# Altium project InterfaceBoard.PrjPcb
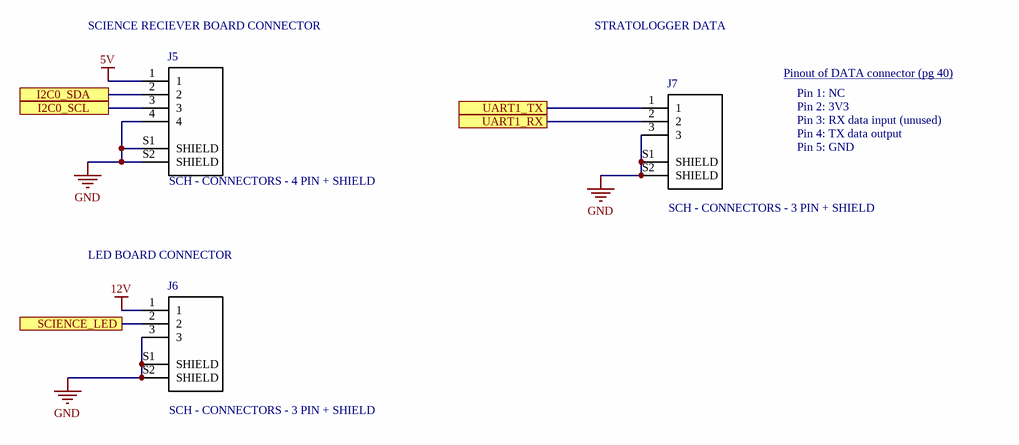
[diagram p0: Board_Conns.SchDoc]
6 sheets, 53 parts. Net scope: flat (ports and power ports of the same name join across sheets).
Board file: InterfaceBoard.PcbDoc
Sheets:
  Board_Conns.SchDoc
  Buzzer_and_Solenoid.SchDoc
  Deploy_Switches.SchDoc
  EMatches.SchDoc
  MEZZANINE.SchDoc
  Table_of_Contents.SchDoc

## Sheet Board_Conns.SchDoc: SPEX - INTERFACE - CONNS
size A4; Author: Derek Belsky; Revision: 0; SheetNumber: 6; SheetTotal: 6

### Parts
J5  SCH - CONNECTORS - 4 PIN + SHIELD  [PCB - CONNECTOR - MOLEX - PICO-LOCK 5037630491]
J6  SCH - CONNECTORS - 3 PIN + SHIELD  [PCB - CONNECTOR - MOLEX - PICO-LOCK 5037630391]
J7  SCH - CONNECTORS - 3 PIN + SHIELD  [PCB - CONNECTOR - MOLEX - PICO-LOCK 5037630391]

### Ports
I2C0_SCL, I2C0_SDA, SCIENCE_LED, UART1_RX, UART1_TX

### Nets
5V: J5.1
12V: J6.1
GND: J5.4 J5.S1(SHIELD) J5.S2(SHIELD) J6.3 J6.S1(SHIELD) J6.S2(SHIELD) J7.3 J7.S1(SHIELD) J7.S2(SHIELD)
I2C0_SCL: J5.3 ; port I2C0_SCL
I2C0_SDA: J5.2 ; port I2C0_SDA
SCIENCE_LED: J6.2 ; port SCIENCE_LED
UART1_S2T: J7.2 ; port UART1_RX
UART1_T2S: J7.1 ; port UART1_TX

### Notes on the sheet
- (near J5) SCIENCE RECIEVER BOARD CONNECTOR
- STRATOLOGGER DATA
- Pinout of DATA connector (pg 40) <http://www.perfectflite.com/Downloads/StratoLoggerCF%20manual.pdf>
- Pin 1: NC
- Pin 2: 3V3
- Pin 3: RX data input (unused)
- Pin 4: TX data output
- Pin 5: GND
- (near J6) LED BOARD CONNECTOR
- Title
- Size:
- Date:
- A4
- Author
- Time:
- Sheet
- Revision:
- of
- RIT Space Exploration Team
- Rochester Institute of Technology
- 1 Lomb Memorial Drive
- Rochester, NY 14623
- https://spex.rit.edu
- File:

### Library data of the parts
J5 = SCH - CONNECTORS - 4 PIN + SHIELD: Connector Header Surface Mount, Right Angle 4 position 0.039 _1.00mm_; MF: Molex; MP: 5037630491; SnapEDA_Link: https://www.snapeda.com/parts/5037630491/Molex/view-part/3215405/?ref=snap; Package: None; Price: None; Availability: Unavailable; Value: *
J6 J7 = SCH - CONNECTORS - 3 PIN + SHIELD: Connector Header Surface Mount, Right Angle 4 position 0.039 _1.00mm_; MF: Molex; MP: 5037630491; SnapEDA_Link: https://www.snapeda.com/parts/5037630491/Molex/view-part/3215405/?ref=snap; Package: None; Price: None; Availability: Unavailable; Value: *

## Sheet Buzzer_and_Solenoid.SchDoc: SPEX - INTERFACE - BUZZER
size A4; Author: Derek Belsky; Revision: 0; SheetNumber: 5; SheetTotal: 6
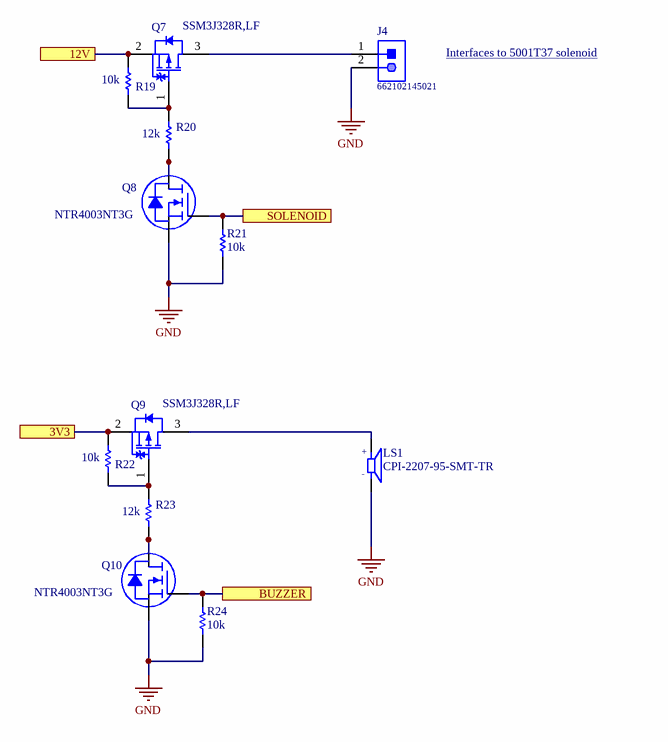
[diagram p1: Buzzer_and_Solenoid.SchDoc]

### Parts
J4  662102145021  [662102145021]
LS1  CPI-2207-95-SMT-TR  [XDCR_CPI-2207-95-SMT-TR]
Q7  SSM3J328R,LF  [TOSH-SOT-23F_V]
Q8  NTR4003NT3G  [ON SEMI SOT-23-3]
Q9  SSM3J328R,LF  [TOSH-SOT-23F_V]
Q10  NTR4003NT3G  [ON SEMI SOT-23-3]
R19  value 10k  [RESC1609X50X30NL8T20]  (hidden comment: CRCW060310K0FKEA)
R20  value 12k  [RESC1609X50X30LL10T20]  (hidden comment: CRCW060312K0FKEA)
R21  value 10k  [RESC1609X50X30NL8T20]  (hidden comment: CRCW060310K0FKEA)
R22  value 10k  [RESC1609X50X30NL8T20]  (hidden comment: CRCW060310K0FKEA)
R23  value 12k  [RESC1609X50X30LL10T20]  (hidden comment: CRCW060312K0FKEA)
R24  value 10k  [RESC1609X50X30NL8T20]  (hidden comment: CRCW060310K0FKEA)

### Ports
3V3, 12V, BUZZER, SOLENOID

### Nets
GND: J4.2 LS1.N Q8.2(S) Q10.2(S) R21.2 R24.2
BUZZER: Q10.1(G) R24.1 ; port BUZZER
SOLENOID: Q8.1(G) R21.1 ; port SOLENOID
NetJ4_1: J4.1 Q7.3(D)
NetLS1_P: LS1.P Q9.3(D)
NetQ7_1: Q7.1(G) R19.1 R20.2
NetQ7_2: Q7.2(S) R19.2 ; port 12V
NetQ8_3: Q8.3(D) R20.1
NetQ9_1: Q9.1(G) R22.1 R23.2
NetQ9_2: Q9.2(S) R22.2 ; port 3V3
NetQ10_3: Q10.3(D) R23.1

### Notes on the sheet
- Interfaces to 5001T37 solenoid <https://www.mcmaster.com/5001t37>
- Title
- Size:
- Date:
- A4
- Author:
- Time:
- Sheet
- Revision:
- of
- RIT Space Exploration Team
- Rochester Institute of Technology
- 1 Lomb Memorial Drive
- Rochester, NY 14623
- https://spex.rit.edu
- File:
- (in symbol CPI-2207-95-SMT-TR) +; -

### Library data of the parts
J4 = CMP-1502-00482-1: SMT Male Header WR-MPC3, with SMT Solder Tabs, Right Angled, Single Row, pitch 3 mm, 2 pins; Manufacturer: Wurth Elektronik; Contact Resistance: 10mOhm; Working Voltage: 250VAC; Pitch: 3mm; Pin Number: 2; Mounting Technology: SMT; Orientation: RightAngled; Part Number: 662102145021; Datasheet URL: https://katalog.we-online.de/em/datasheet/6621xx145021.pdf; Manufacturer URL: http://www.we-online.de; Packaging: TapeandReel; Publisher: WurthElektronik; Gender: Male; Operating Temperature: -40to105degC; Package Reference: 662102145021
LS1 = CPI-2207-95-SMT-TR: 22.1 mm, 12 Vdc, 95 dB, Surface Mount, Driving Circuit, Piezo Audio Indicator Buzzer; MF: CUI Devices; CUI_purchase_URL: https://www.cuidevices.com/product/audio/buzzers/audio-indicators/cpi-2207-95-smt-tr?utm_source=snapeda.com&utm_medium=referral&utm_campaign=snapedaBOM; Digi-Key_Purchase_URL: https://www.digikey.com/product-detail/en/cui-devices/CPI-2207-95-SMT-TR/2223-CPI-2207-95-SMT-CT-ND/11591340?utm_source=snapeda&utm_medium=aggregator&utm_campaign=symbol; Digi-Key_Part_Number: 2223-CPI-2207-95-SMT-CT-ND; Package: CUI Devices; Value: *; SnapEDA_Link: https://www.snapeda.com/parts/CPI-2207-95-SMT-TR/CUI%20Devices/view-part/4502466/?ref=snap; MP: CPI-2207-95-SMT-TR
Q7 Q9 = CMP-2100-03686-1: TOSHIBA Field-Effect Transistor Silicon P-Channel MOS Type (U-MOS VI), 20 V, -55 to 125 degC, 3-Pin SOTFL, RoHS, Tape and Reel; Gate to Source Voltage (Vgs): 8V; Drain to Source Breakdown Voltage: -20V; Turn-Off Delay Time: 107ns; Continuous Drain Current (ID): 6A; Rds On Max: 29.8mOhm; Number of Elements: 1; Turn-On Delay Time: 32ns; Drain to Source Resistance: 47.4mOhm; Drain to Source Voltage (Vdss): 20V; Power Dissipation: 2W; Element Configuration: Single; Max Power Dissipation: 1W; Input Capacitance: 840pF; Manufacturer URL: http://www.toshiba.com/; Number of Pins: 3; Number of Channels: 1; Max Operating Temperature: 150degC; Min Operating Temperature: -55degC; Manufacturer: Toshiba; Mount: SurfaceMount; Package Description: 3-Pin Small Outline Transistor, Flat Lead, Body 2.9 x 1.8 mm, Pitch 0.95 mm; Radiation Hardening: No; Package Quantity: 3000; Package Reference: SOT-23F; RoHSCompliant: true; Package URL: https://toshiba.semicon-storage.com/ap-en/design-support/package/detail.SOT-23F.html; Packaging: TapeandReel; Datasheet Version: 41699.0; Case/Package: SOT-23-3; Datasheet URL: https://toshiba.semicon-storage.com/info/docget.jsp?did=2429&prodName=SSM3J328R
Q8 Q10 = NTR4003NT3G: MOSFET N-CH 30V 500MA SOT-23; Manufacturer: ON Semiconductor; Current - Continuous Drain (Id) @ 25°C: 500mA (Ta); Drive Voltage (Max Rds On,  Min Rds On): 2.5V, 4V; FET Type: N-Channel; Gate Charge (Qg) (Max) @ Vgs: 1.15nC @ 5V; Input Capacitance (Ciss) (Max) @ Vds: 21pF @ 5V; Power Dissipation (Max): 690mW (Ta); Rds On (Max) @ Id, Vgs: 1.5Ohm @ 10mA, 4V; Vgs (Max): ±20V; Vgs(th) (Max) @ Id: 1.4V @ 250µA; Part Number: NTR4003NT3G; ComponentLink1Description: Datasheet; ComponentLink1URL: http://www.onsemi.com/pub/Collateral/NTR4003N-D.PDF; ComponentLink2Description: DigiKey Link; ComponentLink2URL: http://digikey.com/product-detail/en/on-semiconductor/NTR4003NT3G/NTR4003NT3GOSCT-ND/1967271; Device Package: TO-236-3, SC-59, SOT-23-3; Drain to Source Voltage (Vdss): 30V; LastUpdated: 1/21/2020 4:01:12 AM; Lifecycle Status: Active; Minimum Order: 1; Mounting Type: Surface Mount; Operating Temperature: -55°C ~ 150°C (TJ); Package / Case: TO-236-3, SC-59, SOT-23-3; Packaging: TapeAndReel; Part Status: Active; Price: 0.04; Series: -; Supplier 1: DigiKey; Supplier Part Number 1: NTR4003NT3GOSCT-ND; Supplier Device Package: SOT-23-3 (TO-236); Technology: MOSFET (Metal Oxide)
R19 R21 R22 R24 = CMP-1666-00005-4: Chip Resistor, 10 KOhm, +/- 1%, 100 mW, -55 to 155 degC, 0603 (1608 Metric), RoHS, Tape and Reel; Manufacturer: Vishay Semiconductor; Voltage Rating: 75 V; Max Operating Temperature: 155 degC; PackageDescription: 2-Pin Surface Mount Device, Body 1.575 x 0.85 mm; ComponentLink1Description: Manufacturer URL; RoHSCompliant: true; PackageReference: 0603; REACH SVHC: Unknown; Length: 1.55 mm; DatasheetVersion: 06/2012; Packaging: Tape and Reel; Min Operating Temperature: -55 degC; Mounting Technology: Surface Mount; ComponentLink2URL: https://datasheet.ciiva.com/11809/0900766b80d98afc-11809037.pdf; Height: 0.45 mm; ComponentLink2Description: Datasheet; Package Quantity: 5000; ComponentLink1URL: http://www.vishay.com/
R20 R23 = CMP-2000-03877-1: Manufacturer: Vishay Dale; Part Number: CRCW060312K0FKEA

## Sheet Deploy_Switches.SchDoc: SPEX - INTERFACE - SWITCHES
size A4; Author: Derek Belsky; Revision: 0; SheetNumber: 4; SheetTotal: 6
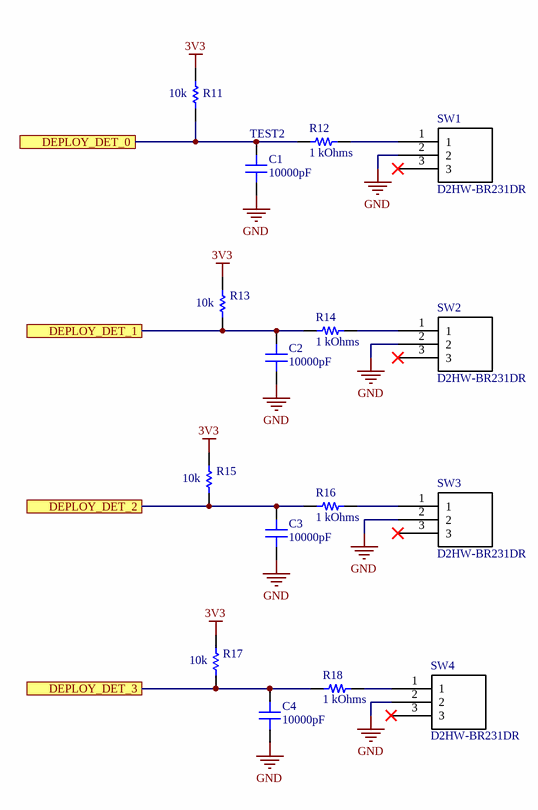
[diagram p2: Deploy_Switches.SchDoc]

### Parts
C1  10000pF  [CAP 0603_1608]
C2  10000pF  [CAP 0603_1608]
C3  10000pF  [CAP 0603_1608]
C4  10000pF  [CAP 0603_1608]
R11  value 10k  [RES 0603_1608]  (hidden comment: 1 kOhms)
R12  1 kOhms  [RES 0603_1608]
R13  value 10k  [RESC1609X50X30NL8T20]  (hidden comment: CRCW060310K0FKEA)
R14  1 kOhms  [RES 0603_1608]
R15  value 10k  [RES 0603_1608]  (hidden comment: 1 kOhms)
R16  value 1 kOhms  [RESC1609X50X30NL8T20]  (hidden comment: CRCW060310K0FKEA)
R17  value 10k  [RES 0603_1608]  (hidden comment: 1 kOhms)
R18  value 1 kOhms  [RESC1609X50X30NL8T20]  (hidden comment: CRCW060310K0FKEA)
SW1  D2HW-BR231DR
SW2  D2HW-BR231DR
SW3  D2HW-BR231DR
SW4  D2HW-BR231DR

### Ports
DEPLOY_DET_0, DEPLOY_DET_1, DEPLOY_DET_2, DEPLOY_DET_3

### Nets
3V3: R11.2 R13.2 R15.2 R17.2
GND: C1.1 C2.1 C3.1 C4.1 SW1.2 SW2.2 SW3.2 SW4.2
DEPLOY_DET_0: C1.2 R11.2 R12.1 ; port DEPLOY_DET_0
DEPLOY_DET_1: C2.2 R13.1 R14.1 ; port DEPLOY_DET_1
DEPLOY_DET_2: C3.2 R15.2 R16.1 ; port DEPLOY_DET_2
DEPLOY_DET_3: C4.2 R17.2 R18.1 ; port DEPLOY_DET_3
NetR12_2: R12.2 SW1.1
NetR14_2: R14.2 SW2.1
NetR16_2: R16.2 SW3.1
NetR18_2: R18.2 SW4.1

Not connected (* = marked no-connect by the designer): SW1 3*; SW2 3*; SW3 3*; SW4 3*

### Notes on the sheet
- (near C1) TEST2
- Title
- Size:
- Date:
- A4
- Author:
- Time:
- Sheet
- Revision:
- of
- RIT Space Exploration Team
- Rochester Institute of Technology
- 1 Lomb Memorial Drive
- Rochester, NY 14623
- https://spex.rit.edu
- File:

### Library data of the parts
C1-C4 = C0603S103K4RACTU: CAP CER 10000PF 16V X7R 0603; Manufacturer: KEMET; Tolerance: ±10%; Part Number: C0603S103K4RACTU; Value: 10000pF; Applications: Boardflex Sensitive; Capacitance: 10000pF; ComponentLink1Description: Datasheet; ComponentLink1URL: https://api.kemet.com/component-edge/download/datasheet/C0603S103K4RACTU.pdf; ComponentLink2Description: DigiKey Link; ComponentLink2URL: http://digikey.com/product-detail/en/kemet/C0603S103K4RACTU/399-9135-1-ND/3522653; Device Package: 0603 (1608 Metric); Features: Floating Electrode; LastUpdated: 1/21/2020 12:02:08 AM; Lifecycle Status: Active; Minimum Order: 1; Mounting Type: Surface Mount, MLCC; Operating Temperature: -55°C ~ 125°C; Package / Case: 0603 (1608 Metric); Packaging: TapeAndReel; PartId: 3312; Part Status: Active; Price: 0.07; Series: SMD Comm X7R FE; Size / Dimension: 0.063" L x 0.031" W (1.60mm x 0.80mm); Supplier 1: DigiKey; Supplier Part Number 1: 399-9135-1-ND; Temperature Coefficient: X7R; Thickness (Max): 0.034" (0.87mm); Voltage - Rated: 16V
R11 R13 R15 R17 = CMP-1666-00005-4: as R19 on sheet Buzzer_and_Solenoid; Max Operating Temperature: 155 degC; PackageDescription: 2-Pin Surface Mount Device, Body 1.575 x 0.85 mm; ComponentLink1Description: Manufacturer URL; RoHSCompliant: true; PackageReference: 0603; REACH SVHC: Unknown; Length: 1.55 mm; DatasheetVersion: 06/2012; Packaging: Tape and Reel; Min Operating Temperature: -55 degC; Mounting Technology: Surface Mount; ComponentLink2URL: https://datasheet.ciiva.com/11809/0900766b80d98afc-11809037.pdf; Height: 0.45 mm; ComponentLink2Description: Datasheet; Package Quantity: 5000; ComponentLink1URL: http://www.vishay.com/
R12 R14 R16 R18 = CPF0603B1K0E: RES SMD 1K OHM 0.1% 1/16W 0603; Manufacturer: TE Connectivity Passive Product; Power (Watts): 0.063W, 1/16W; Temperature Coefficient: ±25ppm/°C; Part Number: CPF0603B1K0E; ComponentLink1Description: Datasheet; ComponentLink1URL: https://www.te.com/commerce/DocumentDelivery/DDEController?Action=srchrtrv&DocNm=1773200&DocType=DS&DocLang=English; ComponentLink2Description: DigiKey Link; ComponentLink2URL: http://digikey.com/product-detail/en/te-connectivity-passive-product/CPF0603B1K0E/A119887CT-ND/4966485; Composition: Thin Film; Device Package: 0603 (1608 Metric); Height - Seated (Max): 0.022" (0.55mm); LastUpdated: 1/21/2020 12:24:55 AM; Lifecycle Status: Active; Minimum Order: 1; Number of Terminations: 2; Operating Temperature: -55°C ~ 155°C; Package / Case: 0603 (1608 Metric); Packaging: TapeAndReel; PartId: 4877; Part Status: Active; Price: 0.09; Resistance: 1 kOhms; Series: CPF, Neohm; Size / Dimension: 0.061" L x 0.031" W (1.55mm x 0.80mm); Supplier 1: DigiKey; Supplier Part Number 1: A119887CT-ND; Supplier Device Package: 0603; Tolerance: ±0.1%
  R12 R14: Value: 1 kOhms

## Sheet EMatches.SchDoc: SPEX - INTERFACE - EMATCHES
size A4; Author: Derek Belsky; Revision: 0; SheetNumber: 3; SheetTotal: 6
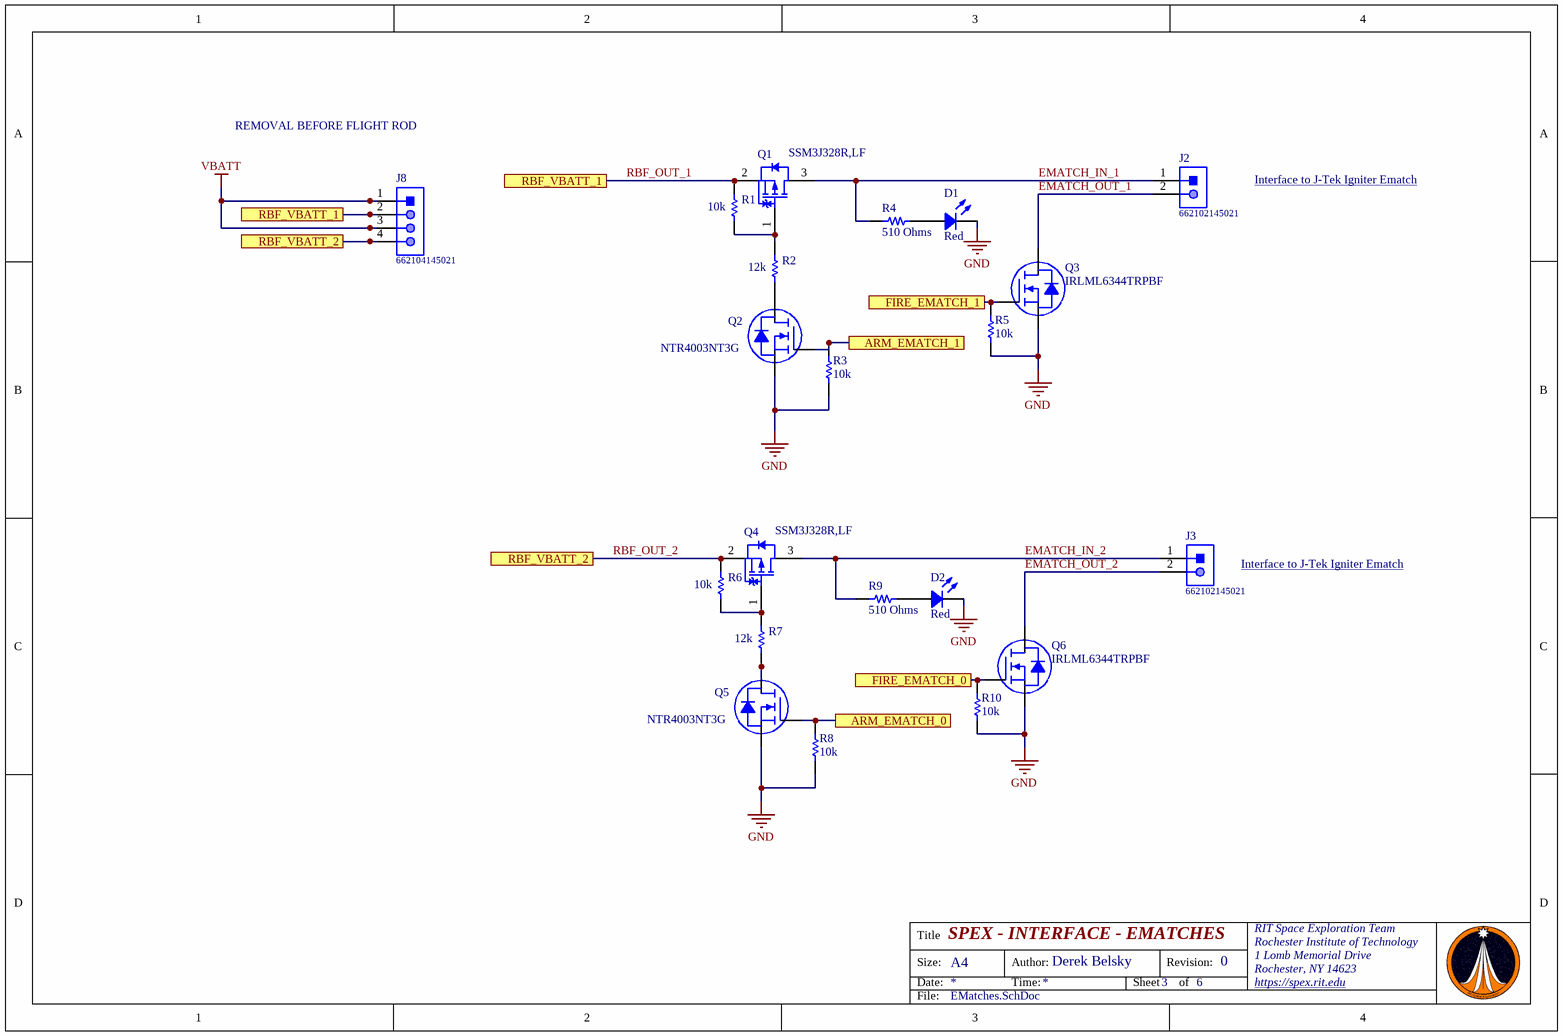
[diagram p3: EMatches.SchDoc]

### Parts
D1  Red  [LED 1206_3216 RED]
D2  Red  [LED 1206_3216 RED]
J2  662102145021  [662102145021]
J3  662102145021  [662102145021]
J8  662104145021  [662104145021]
Q1  SSM3J328R,LF  [TOSH-SOT-23F_V]
Q2  NTR4003NT3G  [ON SEMI SOT-23-3]
Q3  IRLML6344TRPBF  [INFINEON SOT-23-3]
Q4  SSM3J328R,LF  [TOSH-SOT-23F_V]
Q5  NTR4003NT3G  [ON SEMI SOT-23-3]
Q6  IRLML6344TRPBF  [INFINEON SOT-23-3]
R1  value 10k  [RESC1609X50X30NL8T20]  (hidden comment: CRCW060310K0FKEA)
R2  value 12k  [RESC1609X50X30LL10T20]  (hidden comment: CRCW060312K0FKEA)
R3  value 10k  [RESC1609X50X30NL8T20]  (hidden comment: CRCW060310K0FKEA)
R4  510 Ohms  [RES 0603_1608]
R5  value 10k  [RESC1609X50X30NL8T20]  (hidden comment: CRCW060310K0FKEA)
R6  value 10k  [RESC1609X50X30NL8T20]  (hidden comment: CRCW060310K0FKEA)
R7  value 12k  [RESC1609X50X30LL10T20]  (hidden comment: CRCW060312K0FKEA)
R8  value 10k  [RESC1609X50X30NL8T20]  (hidden comment: CRCW060310K0FKEA)
R9  510 Ohms  [RES 0603_1608]
R10  value 10k  [RESC1609X50X30NL8T20]  (hidden comment: CRCW060310K0FKEA)

### Ports
ARM_EMATCH_0, ARM_EMATCH_1, FIRE_EMATCH_0, FIRE_EMATCH_1, RBF_VBATT_1, RBF_VBATT_2

### Nets
GND: D1.2 D2.2 Q2.2(S) Q3.2(S) Q5.2(S) Q6.2(S) R3.2 R5.2 R8.2 R10.2
VBATT: J8.1 J8.3
ARM_EMATCH_0: Q5.1(G) R8.1 ; port ARM_EMATCH_0
ARM_EMATCH_1: Q2.1(G) R3.1 ; port ARM_EMATCH_1
EMATCH_IN_1: J2.1 Q1.3(D) R4.1
EMATCH_IN_2: J3.1 Q4.3(D) R9.1
EMATCH_OUT_1: J2.2 Q3.3(D)
EMATCH_OUT_2: J3.2 Q6.3(D)
FIRE_EMATCH_0: Q6.1(G) R10.1 ; port FIRE_EMATCH_0
FIRE_EMATCH_1: Q3.1(G) R5.1 ; port FIRE_EMATCH_1
RBF_OUT_1: J8.2 Q1.2(S) R1.2 ; port RBF_VBATT_1
RBF_OUT_2: J8.4 Q4.2(S) R6.2 ; port RBF_VBATT_2
NetD1_1: D1.1 R4.2
NetD2_1: D2.1 R9.2
NetQ1_1: Q1.1(G) R1.1 R2.2
NetQ2_3: Q2.3(D) R2.1
NetQ4_1: Q4.1(G) R6.1 R7.2
NetQ5_3: Q5.3(D) R7.1

### Notes on the sheet
- REMOVAL BEFORE FLIGHT ROD
- Interface to J-Tek Igniter Ematch <https://electricmatch.com/pyrotechnics/see/9/5/j-tek-igniter>
- Title
- Size:
- Date:
- A4
- Author:
- Time:
- Sheet
- Revision:
- of
- RIT Space Exploration Team
- Rochester Institute of Technology
- 1 Lomb Memorial Drive
- Rochester, NY 14623
- https://spex.rit.edu
- File:

### Library data of the parts
D1 D2 = HSMC-C350: LED RED CHIP SMD; Manufacturer: Broadcom Limited; Configuration: Standard; Current - Test: 20mA; Lens Color: 1.20mm; Lens Size: 1.10mm Dia; Lens Style: Round with Domed Top; Viewing Angle: 70°; Voltage - Forward (Vf) (Typ): 2V; Wavelength - Dominant: 630nm; Wavelength - Peak: 643nm; Part Number: HSMC-C350; Color: Red; ComponentLink1Description: Datasheet; ComponentLink1URL: https://docs.broadcom.com/docs/HSMC-C350-DS100; ComponentLink2Description: DigiKey Link; ComponentLink2URL: http://digikey.com/product-detail/en/broadcom-limited/HSMC-C350/516-4369-1-ND/10239796; Device Package: 1206 (3216 Metric); Height (Max): 1.20mm; LastUpdated: 1/21/2020 3:14:28 AM; Lifecycle Status: Active; Minimum Order: 1; Mounting Type: Surface Mount; Package / Case: 1206 (3216 Metric); Packaging: TapeAndReel; PartId: 195; Part Status: Active; Price: 0.21; Series: -; Size / Dimension: 3.20mm L x 1.60mm W; Supplier 1: DigiKey; Supplier Part Number 1: 516-4369-1-ND; Supplier Device Package: Chip LED; Value: Red
J2 J3 = CMP-1502-00482-1: as J4 on sheet Buzzer_and_Solenoid; Mounting Technology: SMT; Orientation: RightAngled; Part Number: 662102145021; Datasheet URL: https://katalog.we-online.de/em/datasheet/6621xx145021.pdf; Manufacturer URL: http://www.we-online.de; Packaging: TapeandReel; Publisher: WurthElektronik; Gender: Male; Operating Temperature: -40to105degC; Package Reference: 662102145021
J8 = CMP-1502-00484-1: SMT Male Header WR-MPC3, with SMT Solder Tabs, Right Angled, Single Row, pitch 3 mm, 4 pins; Manufacturer: Wurth Elektronik; Pitch: 3mm; Pin Number: 4; Working Voltage: 250VAC; Contact Resistance: 10mOhm; Part Number: 662104145021; Packaging: TapeandReel; Manufacturer URL: http://www.we-online.de; Orientation: RightAngled; Datasheet URL: https://katalog.we-online.de/em/datasheet/6621xx145021.pdf; Operating Temperature: -40to105degC; Publisher: WurthElektronik; Mounting Technology: SMT; Gender: Male; Package Reference: 662104145021
Q1 Q4 = CMP-2100-03686-1: as Q7 on sheet Buzzer_and_Solenoid; Manufacturer URL: http://www.toshiba.com/; Number of Pins: 3; Number of Channels: 1; Max Operating Temperature: 150degC; Min Operating Temperature: -55degC; Manufacturer: Toshiba; Mount: SurfaceMount; Package Description: 3-Pin Small Outline Transistor, Flat Lead, Body 2.9 x 1.8 mm, Pitch 0.95 mm; Radiation Hardening: No; Package Quantity: 3000; Package Reference: SOT-23F; RoHSCompliant: true; Package URL: https://toshiba.semicon-storage.com/ap-en/design-support/package/detail.SOT-23F.html; Packaging: TapeandReel; Datasheet Version: 41699.0; Case/Package: SOT-23-3; Datasheet URL: https://toshiba.semicon-storage.com/info/docget.jsp?did=2429&prodName=SSM3J328R
Q2 Q5 = NTR4003NT3G: as Q8 on sheet Buzzer_and_Solenoid; Part Number: NTR4003NT3G; ComponentLink1Description: Datasheet; ComponentLink1URL: http://www.onsemi.com/pub/Collateral/NTR4003N-D.PDF; ComponentLink2Description: DigiKey Link; ComponentLink2URL: http://digikey.com/product-detail/en/on-semiconductor/NTR4003NT3G/NTR4003NT3GOSCT-ND/1967271; Device Package: TO-236-3, SC-59, SOT-23-3; Drain to Source Voltage (Vdss): 30V; LastUpdated: 1/21/2020 4:01:12 AM; Lifecycle Status: Active; Minimum Order: 1; Mounting Type: Surface Mount; Operating Temperature: -55°C ~ 150°C (TJ); Package / Case: TO-236-3, SC-59, SOT-23-3; Packaging: TapeAndReel; Part Status: Active; Price: 0.04; Series: -; Supplier 1: DigiKey; Supplier Part Number 1: NTR4003NT3GOSCT-ND; Supplier Device Package: SOT-23-3 (TO-236); Technology: MOSFET (Metal Oxide)
Q3 Q6 = IRLML6344TRPBF: MOSFET N-CH 30V 5A SOT23; Manufacturer: Infineon Technologies; Current - Continuous Drain (Id) @ 25°C: 5A (Ta); Drive Voltage (Max Rds On,  Min Rds On): 2.5V, 4.5V; FET Type: N-Channel; Gate Charge (Qg) (Max) @ Vgs: 6.8nC @ 4.5V; Input Capacitance (Ciss) (Max) @ Vds: 650pF @ 25V; Power Dissipation (Max): 1.3W (Ta); Rds On (Max) @ Id, Vgs: 29mOhm @ 5A, 4.5V; Vgs (Max): ±12V; Vgs(th) (Max) @ Id: 1.1V @ 10µA; Part Number: IRLML6344TRPBF; ComponentLink1Description: Datasheet; ComponentLink1URL: https://www.infineon.com/dgdl/irlml6344pbf.pdf?fileId=5546d462533600a4015356689c44262c; ComponentLink2Description: DigiKey Link; ComponentLink2URL: http://digikey.com/product-detail/en/infineon-technologies/IRLML6344TRPBF/IRLML6344TRPBFCT-ND/2538168; Device Package: TO-236-3, SC-59, SOT-23-3; Drain to Source Voltage (Vdss): 30V; LastUpdated: 1/21/2020 4:00:48 AM; Lifecycle Status: Active; Minimum Order: 1; Mounting Type: Surface Mount; Operating Temperature: -55°C ~ 150°C (TJ); Package / Case: TO-236-3, SC-59, SOT-23-3; Packaging: TapeAndReel; Part Status: Active; Price: 0.12; Series: HEXFET®; Supplier 1: DigiKey; Supplier Part Number 1: IRLML6344TRPBFCT-ND; Supplier Device Package: Micro3™/SOT-23; Technology: MOSFET (Metal Oxide)
R1 R3 R5 R6 R8 R10 = CMP-1666-00005-4: as R19 on sheet Buzzer_and_Solenoid; Max Operating Temperature: 155 degC; PackageDescription: 2-Pin Surface Mount Device, Body 1.575 x 0.85 mm; ComponentLink1Description: Manufacturer URL; RoHSCompliant: true; PackageReference: 0603; REACH SVHC: Unknown; Length: 1.55 mm; DatasheetVersion: 06/2012; Packaging: Tape and Reel; Min Operating Temperature: -55 degC; Mounting Technology: Surface Mount; ComponentLink2URL: https://datasheet.ciiva.com/11809/0900766b80d98afc-11809037.pdf; Height: 0.45 mm; ComponentLink2Description: Datasheet; Package Quantity: 5000; ComponentLink1URL: http://www.vishay.com/
R2 R7 = CMP-2000-03877-1: Manufacturer: Vishay Dale; Part Number: CRCW060312K0FKEA
R4 R9 = CRCW0603510RFKEAHP: RES SMD 510 OHM 1% 1/4W 0603; Manufacturer: Vishay Dale; Power (Watts): 0.25W, 1/4W; Temperature Coefficient: ±100ppm/°C; Part Number: CRCW0603510RFKEAHP; Value: 510 Ohms; ComponentLink1Description: Datasheet; ComponentLink1URL: http://www.vishay.com/docs/20043/crcwhpe3.pdf; ComponentLink2Description: DigiKey Link; ComponentLink2URL: http://digikey.com/product-detail/en/vishay-dale/CRCW0603510RFKEAHP/541-510SCT-ND/5326852; Composition: Thick Film; Device Package: 0603 (1608 Metric); Features: Automotive AEC-Q200, Pulse Withstanding; Height - Seated (Max): 0.022" (0.55mm); LastUpdated: 1/21/2020 12:20:58 AM; Lifecycle Status: Active; Minimum Order: 1; Number of Terminations: 2; Operating Temperature: -55°C ~ 155°C; Package / Case: 0603 (1608 Metric); Packaging: TapeAndReel; PartId: 14772; Part Status: Active; Price: 0.02; Ratings: AEC-Q200; Resistance: 510 Ohms; Series: CRCW-HP; Size / Dimension: 0.063" L x 0.033" W (1.60mm x 0.85mm); Supplier 1: DigiKey; Supplier Part Number 1: 541-510SCT-ND; Supplier Device Package: 0603; Tolerance: ±1%

## Sheet MEZZANINE.SchDoc: SPEX - INTERFACE - MEZZANINE
size A4; Author: Derek Belsky; Revision: 0; SheetNumber: 2; SheetTotal: 6
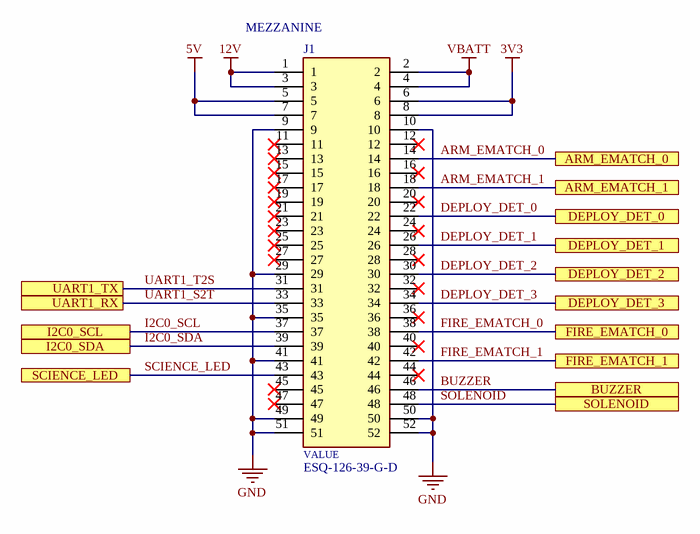
[diagram p4: MEZZANINE.SchDoc]

### Parts
J1  ESQ-126-39-G-D  [SAMTEC_ESQ-126-39-G-D]

### Ports
ARM_EMATCH_0, ARM_EMATCH_1, BUZZER, DEPLOY_DET_0, DEPLOY_DET_1, DEPLOY_DET_2, DEPLOY_DET_3, FIRE_EMATCH_0, FIRE_EMATCH_1, I2C0_SCL, I2C0_SDA, SCIENCE_LED, SOLENOID, UART1_RX, UART1_TX

### Nets
3V3: J1.6 J1.8
5V: J1.5 J1.7
12V: J1.1 J1.3
GND: J1.9 J1.10 J1.29 J1.35 J1.41 J1.49 J1.50 J1.51 J1.52
VBATT: J1.2 J1.4
ARM_EMATCH_0: J1.14 ; port ARM_EMATCH_0
ARM_EMATCH_1: J1.18 ; port ARM_EMATCH_1
BUZZER: J1.46 ; port BUZZER
DEPLOY_DET_0: J1.22 ; port DEPLOY_DET_0
DEPLOY_DET_1: J1.26 ; port DEPLOY_DET_1
DEPLOY_DET_2: J1.30 ; port DEPLOY_DET_2
DEPLOY_DET_3: J1.34 ; port DEPLOY_DET_3
FIRE_EMATCH_0: J1.38 ; port FIRE_EMATCH_0
FIRE_EMATCH_1: J1.42 ; port FIRE_EMATCH_1
I2C0_SCL: J1.37 ; port I2C0_SCL
I2C0_SDA: J1.39 ; port I2C0_SDA
SCIENCE_LED: J1.43 ; port SCIENCE_LED
SOLENOID: J1.48 ; port SOLENOID
UART1_S2T: J1.33 ; port UART1_RX
UART1_T2S: J1.31 ; port UART1_TX

Not connected (* = marked no-connect by the designer): J1 11* 12* 13* 15* 16* 17* 19* 20* 21* 23* 24* 25* 27* 28* 32* 36* 40* 44* 45* 47*

### Notes on the sheet
- (near J1) MEZZANINE
- Title
- Size:
- Date:
- A4
- Author
- Time:
- Sheet
- Revision:
- of
- RIT Space Exploration Team
- Rochester Institute of Technology
- 1 Lomb Memorial Drive
- Rochester, NY 14623
- https://spex.rit.edu
- File:
- (in symbol ESQ-126-39-G-D) VALUE

### Library data of the parts
J1 = ESQ-126-39-G-D: 52 Position Elevated Socket Connector Through Hole; MF: Samtec; Value: *; Digi-Key_Purchase_URL: https://www.digikey.com/product-detail/en/samtec-inc/ESQ-126-39-G-D/SAM10462-ND/3601055?utm_source=snapeda&utm_medium=aggregator&utm_campaign=symbol; Package: None; MP: ESQ-126-39-G-D; SnapEDA_Link: https://www.snapeda.com/parts/ESQ-126-39-G-D/Samtec%20Inc./view-part/490181/?ref=snap; Digi-Key_Part_Number: SAM10462-ND

## Sheet Table_of_Contents.SchDoc: SPEX - INTERFACE -ToC
size A4; Author: Derek Belsky; Revision: 0; SheetNumber: 1; SheetTotal: 6
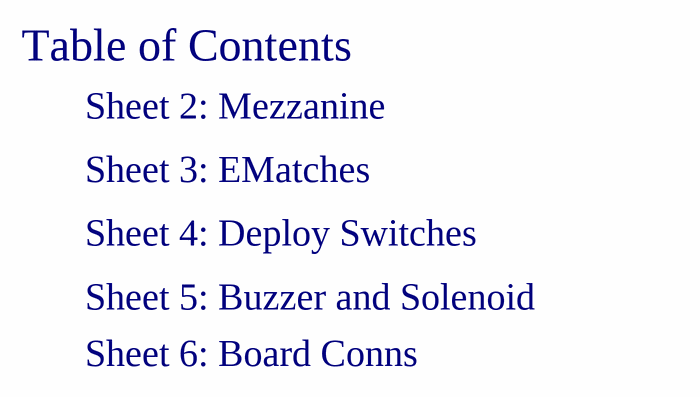
[diagram p5: Table_of_Contents.SchDoc]

### Notes on the sheet
- Table of Contents
- Sheet 2: Mezzanine
- Sheet 3: EMatches
- Sheet 4: Deploy Switches
- Sheet 5: Buzzer and Solenoid
- Sheet 6: Board Conns
- Title
- Size:
- Date:
- A4
- Author:
- Time:
- Sheet
- Revision:
- of
- RIT Space Exploration Team
- Rochester Institute of Technology
- 1 Lomb Memorial Drive
- Rochester, NY 14623
- https://spex.rit.edu
- File:

## Nets that join several sheets
3V3: Deploy_Switches (R11.2 R13.2 R15.2 R17.2), MEZZANINE (J1.6 J1.8)
5V: Board_Conns (J5.1), MEZZANINE (J1.5 J1.7)
12V: Board_Conns (J6.1), MEZZANINE (J1.1 J1.3)
GND: Board_Conns (9 pins), Buzzer_and_Solenoid (6 pins), Deploy_Switches (8 pins), EMatches (10 pins), MEZZANINE (9 pins)
VBATT: EMatches (J8.1 J8.3), MEZZANINE (J1.2 J1.4)
ARM_EMATCH_0: EMatches (Q5.1 R8.1), MEZZANINE (J1.14)
ARM_EMATCH_1: EMatches (Q2.1 R3.1), MEZZANINE (J1.18)
BUZZER: Buzzer_and_Solenoid (Q10.1 R24.1), MEZZANINE (J1.46)
DEPLOY_DET_0: Deploy_Switches (C1.2 R11.2 R12.1), MEZZANINE (J1.22)
DEPLOY_DET_1: Deploy_Switches (C2.2 R13.1 R14.1), MEZZANINE (J1.26)
DEPLOY_DET_2: Deploy_Switches (C3.2 R15.2 R16.1), MEZZANINE (J1.30)
DEPLOY_DET_3: Deploy_Switches (C4.2 R17.2 R18.1), MEZZANINE (J1.34)
FIRE_EMATCH_0: EMatches (Q6.1 R10.1), MEZZANINE (J1.38)
FIRE_EMATCH_1: EMatches (Q3.1 R5.1), MEZZANINE (J1.42)
I2C0_SCL: Board_Conns (J5.3), MEZZANINE (J1.37)
I2C0_SDA: Board_Conns (J5.2), MEZZANINE (J1.39)
SCIENCE_LED: Board_Conns (J6.2), MEZZANINE (J1.43)
SOLENOID: Buzzer_and_Solenoid (Q8.1 R21.1), MEZZANINE (J1.48)
UART1_S2T: Board_Conns (J7.2), MEZZANINE (J1.33)
UART1_T2S: Board_Conns (J7.1), MEZZANINE (J1.31)